# EAGLE design ASD2163 (EAGLE 6.3)
DATABASE: ./../../../../../Components/TinyCircuits_Part_Database.txt
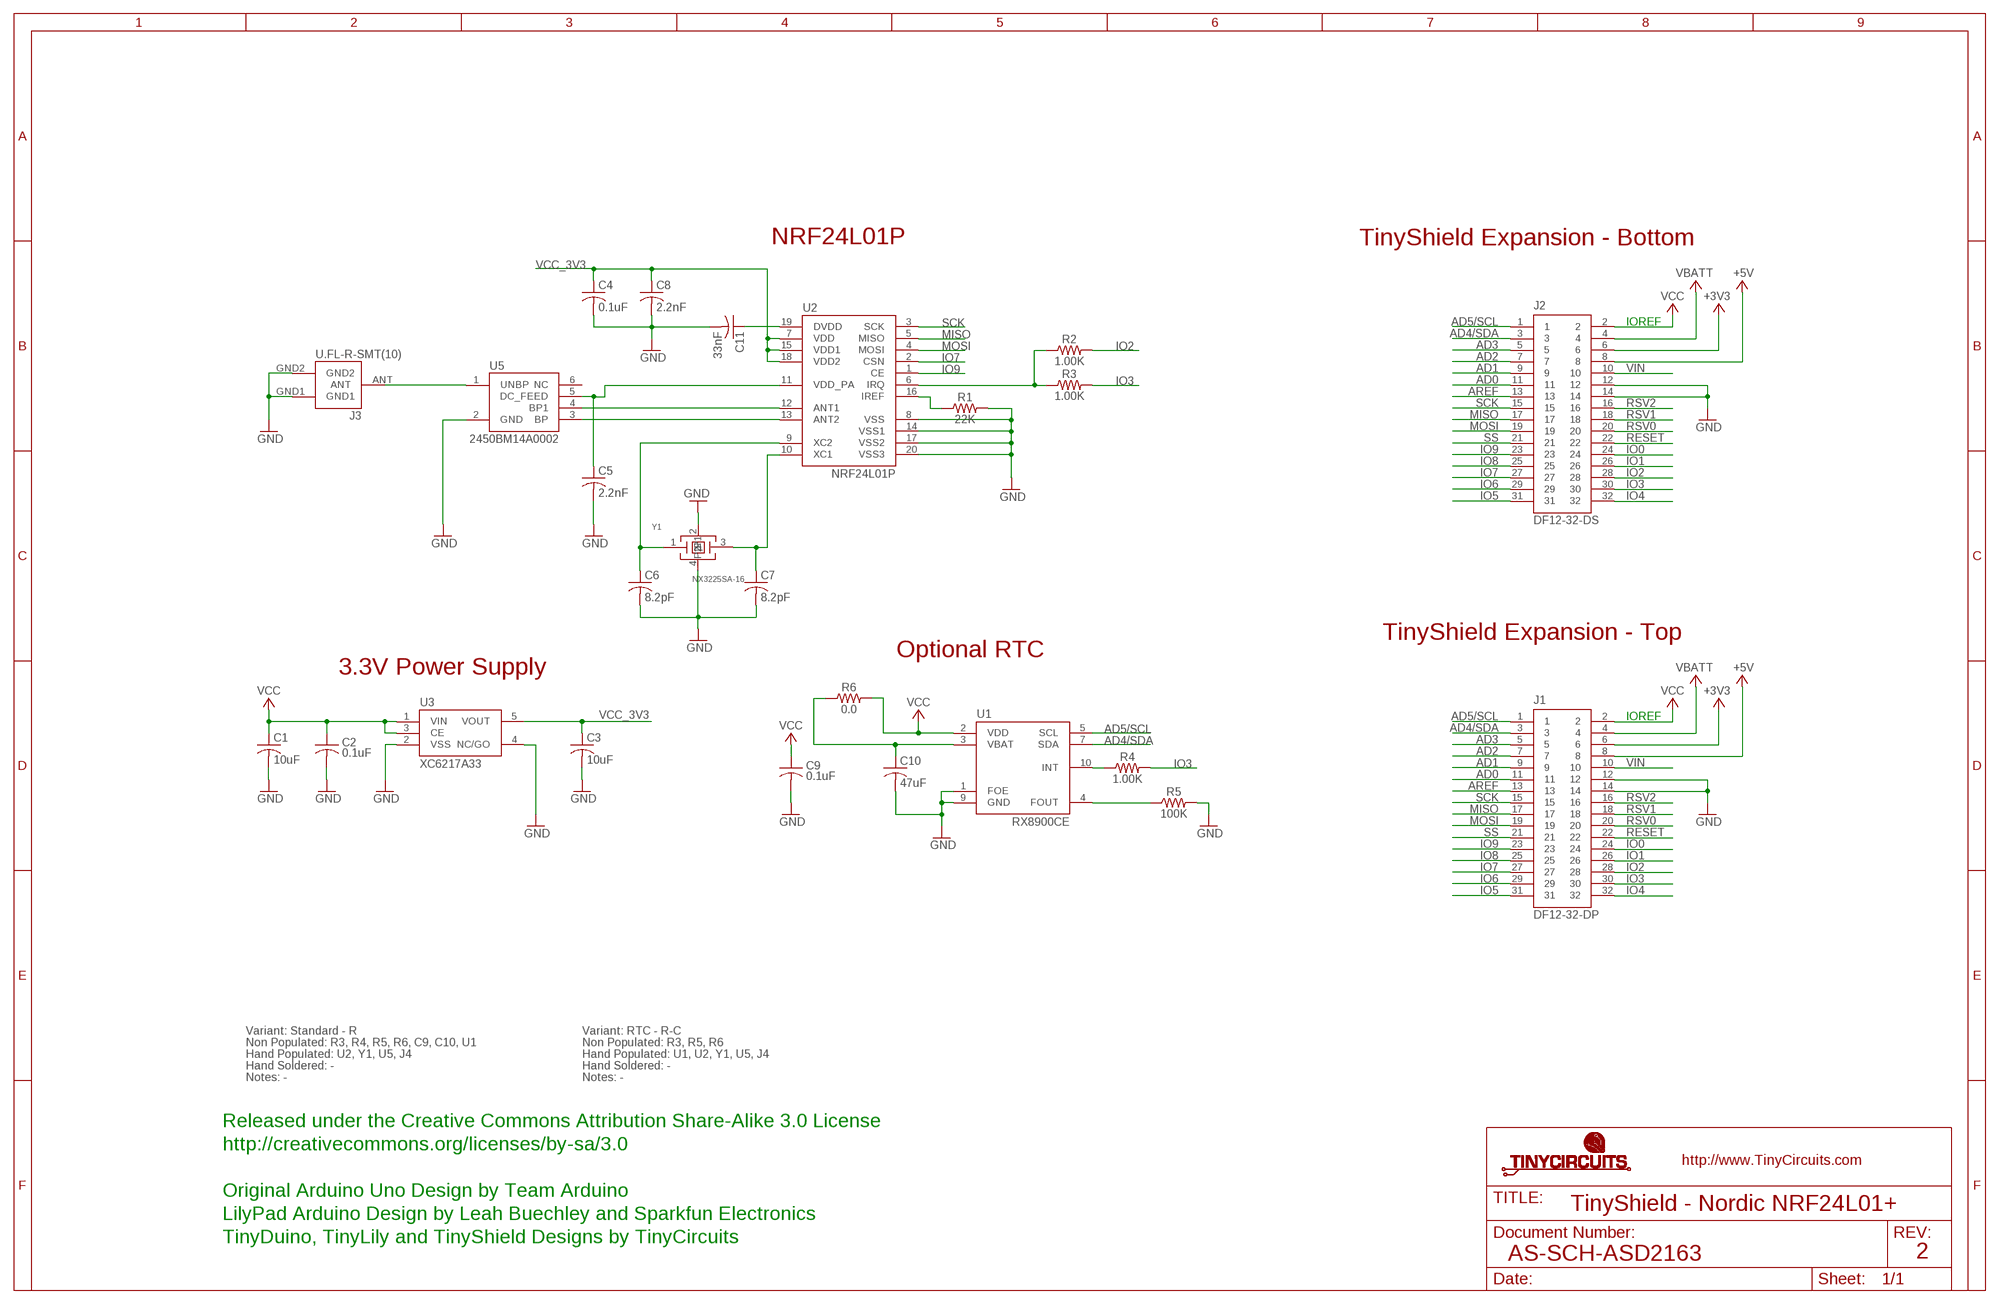
[diagram p0: schematic, sheet 1]

## Parts
C1  10uF  AS-ITM-00002  [C0603]
C2  0.1uF  AS-ITM-00008  [C0402]
C3  10uF  AS-ITM-00002  [C0603]
C4  0.1uF  AS-ITM-00008  [C0402]
C5  2.2nF  AS-ITM-00085  [C0402]
C6  8.2pF  AS-ITM-00247  [C0402]
C7  8.2pF  AS-ITM-00247  [C0402]
C8  2.2nF  AS-ITM-00085  [C0402]
C9  0.1uF  AS-ITM-00008  [C0402]
C10  47uF  AS-ITM-00049  [C1206]
C11  33nF  AS-ITM-00248  [C0402]
J1  DF12-32-DP  AS-ITM-00015  [DF12-32-DP]
J2  DF12-32-DS  AS-ITM-00012  [DF12-32-DS]
J3  U.FL-R-SMT(10)  AS-ITM-00193  [U.FL-R-SMT(10)]
R1  22K  AS-ITM-00147  [0402]
R2  1.00K  AS-ITM-00003  [0402]
R3  1.00K  AS-ITM-00003  [0402]
R4  1.00K  AS-ITM-00003  [0402]
R5  100K  AS-ITM-00004  [0402]
R6  0.0  AS-ITM-00076  [0402]
U1  RX8900CE  AS-ITM-00373  [RX8900CE]
U2  NRF24L01P  AS-ITM-00276  [QFN20-NO_PAD]
U3  XC6217A33  AS-ITM-00249  [SOT-25]
U5  2450BM14A0002  AS-ITM-00114  [2450BM14A0002]
Y1  NX3225SA-16  AS-ITM-00228  [ABM11]

## Nets
+3V3: J1.6 J2.6
+5V: J1.8 J2.8
AD0: J1.11 J2.11
AD1: J1.9 J2.9
AD2: J1.7 J2.7
AD3: J1.5 J2.5
AD4/SDA: J1.3 J2.3 U1.7(SDA)
AD5/SCL: J1.1 J2.1 U1.5(SCL)
AREF: J1.13 J2.13
GND: C1.2 C2.2 C3.2 C4.2 C5.2 C6.2 C7.2 C8.2 C9.2 C10.2 C11.2 J1.12 J1.14 J2.12 J2.14 J3.GND1 J3.GND2 R1.2 R5.2 U1.1(FOE) U1.9(GND) U2.8(VSS) U2.14(VSS1) U2.17(VSS2) U2.20(VSS3) U3.2(VSS) U3.4(NC/GO) U5.2(GND) Y1.2 Y1.4(P1)
IO0: J1.24 J2.24
IO1: J1.26 J2.26
IO2: J1.28 J2.28 R2.2
IO3: J1.30 J2.30 R3.2 R4.2
IO4: J1.32 J2.32
IO5: J1.31 J2.31
IO6: J1.29 J2.29
IO7: J1.27 J2.27 U2.2(CSN)
IO8: J1.25 J2.25
IO9: J1.23 J2.23 U2.1(CE)
MISO: J1.17 J2.17 U2.5(MISO)
MOSI: J1.19 J2.19 U2.4(MOSI)
N$1: R1.1 U2.16(IREF)
N$2: C6.1 U2.9(XC2) Y1.1
N$3: J3.ANT U5.1(UNBP)
N$4: C10.1 R6.1 U1.3(VBAT)
N$5: C11.1 U2.19(DVDD)
N$6: U2.13(ANT2) U5.3(BP)
N$7: U2.12(ANT1) U5.4(BP1)
N$8: C5.1 U2.11(VDD_PA) U5.5(DC_FEED)
N$9: C7.1 U2.10(XC1) Y1.3
N$10: R5.1 U1.4(FOUT)
RDYN: R2.1 R3.1 U2.6(IRQ)
RDYN1: R4.1 U1.10(INT)
RESET: J1.22 J2.22
RSV0: J1.20 J2.20
RSV1: J1.18 J2.18
RSV2: J1.16 J2.16
SCK: J1.15 J2.15 U2.3(SCK)
SS: J1.21 J2.21
VBATT: J1.4 J2.4
VCC: C1.1 C2.1 C9.1 J1.2 J2.2 R6.2 U1.2(VDD) U3.1(VIN) U3.3(CE)
VCC_3V3: C3.1 C4.1 C8.1 U2.7(VDD) U2.15(VDD1) U2.18(VDD2) U3.5(VOUT)
VIN: J1.10 J2.10
Unconnected: U5.6(NC)

## Notes on the sheet
- NRF24L01P | TinyShield Expansion - Bottom
- IOREF
- TinyShield Expansion - Top
- Optional RTC
- 3.3V Power Supply
- IOREF
- Variant: Standard - R | Variant: RTC - R-C
- Non Populated: R3, R4, R5, R6, C9, C10, U1 | Non Populated: R3, R5, R6
- Hand Populated: U2, Y1, U5, J4 | Hand Populated: U1, U2, Y1, U5, J4
- Hand Soldered: - | Hand Soldered: -
- Notes: - | Notes: -
- Released under the Creative Commons Attribution Share-Alike 3.0 License
- http://creativecommons.org/licenses/by-sa/3.0
- Original Arduino Uno Design by Team Arduino
- TinyShield - Nordic NRF24L01+
- LilyPad Arduino Design by Leah Buechley and Sparkfun Electronics
- TinyDuino, TinyLily and TinyShield Designs by TinyCircuits
- AS-SCH-ASD2163 | 2

## Library data of the parts
C1 C3 = tinycircuits:AS-ITM-00002: CAP CER 10UF 10V 20% X5R 0603; PARTNO: AS-ITM-00002
C2 C4 C9 = tinycircuits:AS-ITM-00008: CAP CER 0.1UF 16V 10% X5R 0402; PARTNO: AS-ITM-00008
C5 C8 = tinycircuits:AS-ITM-00085: CAP CER 2.2NF 50V 10% X7R 0402; PARTNO: AS-ITM-00085
C6 C7 = tinycircuits:AS-ITM-00247: CAP CER 8.2PF 50V NP0 0402; PARTNO: AS-ITM-00247
C10 = tinycircuits:AS-ITM-00049: CAP CER 47UF 6.3V 20% X6S 1206; PARTNO: AS-ITM-00049
C11 = tinycircuits:AS-ITM-00248: CAP CER 0.033UF 16V Y5V 0402; PARTNO: AS-ITM-00248
J1 = tinycircuits:AS-ITM-00015: CONN HEADER 32POS 3MM SMD 0.5MM; PARTNO: AS-ITM-00015; PNPROTATION: 0
J2 = tinycircuits:AS-ITM-00012: CONN RECEPT 32POS 3MM SMD 0.5MM; PARTNO: AS-ITM-00012; PNPROTATION: 0
J3 = tinycircuits:AS-ITM-00193: RF COAXIAL CONNECTOR U.FL RECEPTACLE SMT; PARTNO: AS-ITM-00193; PNPROTATION: 270
R1 = tinycircuits:AS-ITM-00147: RES 22K OHM 1/16W 5% 0402 SMD; PARTNO: AS-ITM-00147
R2-R4 = tinycircuits:AS-ITM-00003: RES 1.00K OHM 1/16W 1% 0402; PARTNO: AS-ITM-00003
R5 = tinycircuits:AS-ITM-00004: RES 100K OHM 1/16W 1% 0402; PARTNO: AS-ITM-00004
R6 = tinycircuits:AS-ITM-00076: RES 0.0 OHM 1/16W 1% 0402 SMD; PARTNO: AS-ITM-00076
U1 = tinycircuits:AS-ITM-00373: IC RTC CLK/CALENDAR I2C 10SMD; PARTNO: AS-ITM-00373
U2 = tinycircuits:AS-ITM-00276: IC RF TRANSCEIVER 2.4GHZ 20QFN; PARTNO: AS-ITM-00276
U3 = tinycircuits:AS-ITM-00249: IC REG LDO 3.3V 0.2A SOT25; PARTNO: AS-ITM-00249; PNPROTATION: 270
U5 = tinycircuits:AS-ITM-00114: 2.45 GHz Impredance Matched Balun-Filter; PARTNO: AS-ITM-00114
Y1 = tinycircuits:AS-ITM-00228: CRYSTAL 16MHZ 8PF SMD; PARTNO: AS-ITM-00228; PNPROTATION: 0; VALUE: 8Y-16.000MAAV-T

## Board
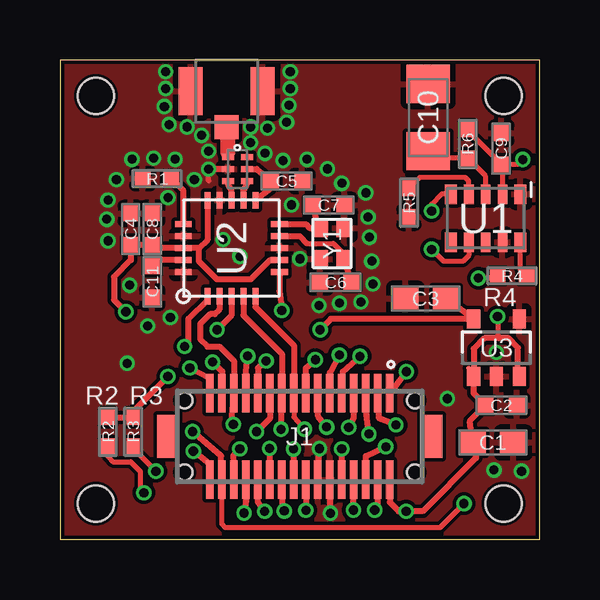
[diagram p1: board, top side]
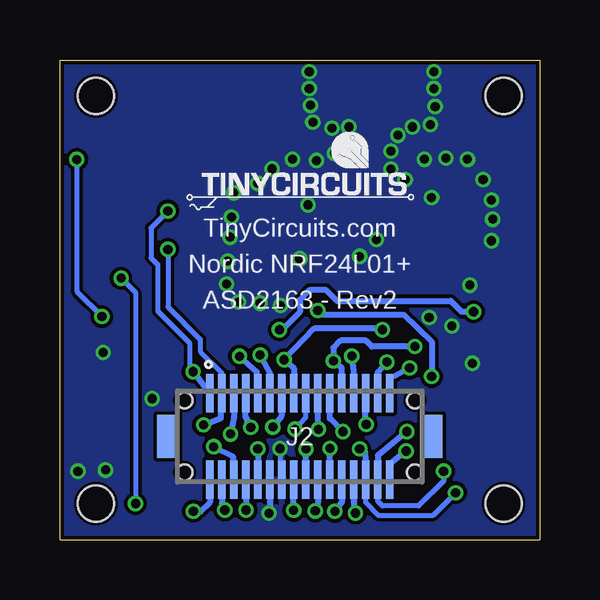
[diagram p2: board, bottom side, seen from below]

Size 20 x 20 mm. Coordinates in mm from the lower left corner, seen from the top.
Outline: 20,0 0,0 0,20 20,20 20,0
Copper layers (1*16): Top 0.035mm / dielectric 1.5mm / Bottom 0.035mm
Design rules "default *": minimum track width 7mil, minimum drill 15mil, track to track 6mil, track to pad 6mil, pad to pad 6mil, via to via 6mil, smd to smd 6mil, copper to edge 6mil, drill to drill 8mil, minimum pad ring 10mil, minimum via ring 5mil, stop-mask expansion 4mil, vias tented up to drill 25mil, thermal gap 10mil
Holes 1.5 mm at 1.5,18.5 18.5,18.5 18.5,1.5 1.5,1.5

### Footprints (pad centres in the part's own frame; a part is rotated, then mirrored left to right if it is on the bottom)
C0603 = smd 1.1 x 1: 1 -0.85,0; 2 0.85,0
C0402 = smd 0.65 x 0.6: 1 -0.65,0; 2 0.65,0
C1206 = smd 1.6 x 1.8: 1 -1.4,0; 2 1.4,0
DF12-32-DP = smd 0.3 x 1.6: 1 -3.75,-1.8; 2 -3.75,1.8; 3 -3.25,-1.8; 4 -3.25,1.8; 5 -2.75,-1.8; 6 -2.75,1.8; 7 -2.25,-1.8; 8 -2.25,1.8; 9 -1.75,-1.8; 10 -1.75,1.8; 11 -1.25,-1.8; 12 -1.25,1.8; 13 -0.75,-1.8; 14 -0.75,1.8; 15 -0.25,-1.8; 16 -0.25,1.8; 17 0.25,-1.8; 18 0.25,1.8; 19 0.75,-1.8; 20 0.75,1.8; 21 1.25,-1.8; 22 1.25,1.8; 23 1.75,-1.8; 24 1.75,1.8; 25 2.25,-1.8; 26 2.25,1.8; 27 2.75,-1.8; 28 2.75,1.8; 29 3.25,-1.8; 30 3.25,1.8; 31 3.75,-1.8; 32 3.75,1.8 | smd 0.9 x 1.8: F1 -5.5,0; F2 5.5,0 | hole 0.65: -4.8,1.5; 4.8,1.5
DF12-32-DS = smd 0.3 x 1.6: 1 -3.75,1.8; 2 -3.75,-1.8; 3 -3.25,1.8; 4 -3.25,-1.8; 5 -2.75,1.8; 6 -2.75,-1.8; 7 -2.25,1.8; 8 -2.25,-1.8; 9 -1.75,1.8; 10 -1.75,-1.8; 11 -1.25,1.8; 12 -1.25,-1.8; 13 -0.75,1.8; 14 -0.75,-1.8; 15 -0.25,1.8; 16 -0.25,-1.8; 17 0.25,1.8; 18 0.25,-1.8; 19 0.75,1.8; 20 0.75,-1.8; 21 1.25,1.8; 22 1.25,-1.8; 23 1.75,1.8; 24 1.75,-1.8; 25 2.25,1.8; 26 2.25,-1.8; 27 2.75,1.8; 28 2.75,-1.8; 29 3.25,1.8; 30 3.25,-1.8; 31 3.75,1.8; 32 3.75,-1.8 | smd 0.9 x 1.8: F1 -5.5,0; F2 5.5,0 | hole 0.65: -4.8,1.5; 4.8,1.5
U.FL-R-SMT(10) = smd 1 x 1: ANT 0,-1.5 | smd 1 x 2: GND1 -1.5,0; GND2 1.5,0
0402 = smd 0.65 x 0.55: 1 -0.6,0; 2 0.6,0
RX8900CE = smd 0.5 x 0.8: 1 -1.45,-1; 5 1.45,-1; 6 1.45,1; 10 -1.45,1 | smd 0.4 x 0.8: 2 -0.7,-1; 3 0,-1; 4 0.7,-1; 7 0.7,1; 8 0,1; 9 -0.7,1
QFN20-NO_PAD = smd 0.7 x 0.25: 1 -2,1; 2 -2,0.5; 3 -2,0; 4 -2,-0.5; 5 -2,-1; 11 2,-1; 12 2,-0.5; 13 2,0; 14 2,0.5; 15 2,1 | smd 0.25 x 0.7: 6 -1,-2; 7 -0.5,-2; 8 0,-2; 9 0.5,-2; 10 1,-2; 16 1,2; 17 0.5,2; 18 0,2; 19 -0.5,2; 20 -1,2
SOT-25 = smd 0.55 x 0.8: 1 -0.95,-1.2; 2 0,-1.2; 3 0.95,-1.2; 4 0.95,1.2; 5 -0.95,1.2
2450BM14A0002 = smd 0.25 x 0.5: 1 0.5,0.4; 2 0,0.4; 3 -0.5,0.4; 4 -0.5,-0.4; 5 0,-0.4; 6 0.5,-0.4
ABM11 = smd 0.75 x 0.65: 1 -0.65,-0.5; 2 0.65,-0.5; 3 0.65,0.5; 4 -0.65,0.5

### Placement (x,y rotation side)
C1  18.05,4.05 0 top
C2  18.4,5.6 0 top
C3  15.25,10.05 180 top
C4  2.95,12.95 90 top
C5  9.45,14.95 0 top
C6  11.49,10.72 180 top
C7  11.21,13.95 0 top
C8  3.85,12.95 90 top
C9  18.4,16.3 90 top
C10  15.35,17.6 90 top
C11  3.85,10.75 270 top
J1  10,4.3 180 top
J2  10,4.3 0 bottom
J3  6.95,18.7 0 top
R1  4.05,15.05 180 top
R2  2,4.5 270 top
R3  3.05,4.5 270 top
R4  18.85,11 180 top
R5  14.55,14.05 270 top
R6  17,16.5 90 top
U1  17.75,13.4 180 top
U2  7.15,12.15 90 top
U3  18.2,8 0 top
U5  7.4,15.45 90 top
U$1  [DOCFIELD-TINYCIRCUITS-PCB]  33.91,-10 0 top  (outside the outline)
Y1  11.35,12.35 90 top

### Tracks (layer width: path | path; a pad name or v marks a point on that pad's centre or on a via)
+3V3  (via drill 0.38)
  Top 0.254: J2.6 12.75,3.47 v13.59,3.87
  Bottom 0.254: v13.59,3.87 12.79,3.46 J2.6
+5V  (via drill 0.38)
  Top 0.254: v12.24,1.23 J2.8
  Bottom 0.254: J2.8 12.25,1.21 v12.24,1.23
AD0  (via drill 0.38)
  Top 0.254: v11.65,7.7 11.25,6.95 J2.11
  Bottom 0.254: J2.11 11.25,6.95 v11.65,7.7
AD1  (via drill 0.38)
  Top 0.254: J2.9 11.79,7 v12.51,7.64
  Bottom 0.254: v12.51,7.64 11.78,7 J2.9
AD2  (via drill 0.38)
  Top 0.254: v12.04,4.68 12.26,5.11 J2.7
  Bottom 0.254: J2.7 12.27,5.16 v12.04,4.68
AD3  (via drill 0.38)
  Top 0.254: v12.88,4.4 12.78,5.22 J2.5
  Bottom 0.254: J2.5 12.75,5.13 v12.88,4.4
AD4/SDA  (via drill 0.38)
  Top 0.203: U1.7 17.05,11.85 16.8,11.6 16,11.6 v15.5,12.1
  Top 0.254: v14.01,4.78 13.31,5.05 J2.3
  Bottom 0.203: v15.5,12.1 15.5,9.7 14.15,8.35 14.15,7.85 13.25,6.95 J2.3
  Bottom 0.254: J2.3 13.28,5.06 v14.01,4.78
AD5/SCL  (via drill 0.38)
  Top 0.203: U1.5 15.9,14.4 15.5,14 v15.5,13.7
  Top 0.254: v14.45,7 J2.1
  Bottom 0.203: v14.45,7 14.6,7.15 14.6,8.2 15.93,9.52 15.93,11.48 16.2,11.75 16.2,13 v15.5,13.7
  Bottom 0.254: J2.1 v14.45,7
AREF  (via drill 0.38)
  Top 0.254: J2.13 10.77,5.14 v11.12,4.69
  Bottom 0.254: v11.12,4.69 10.77,5.14 J2.13
GND  (via drill 0.38)
  Top 0.203: v11.29,1.1 11.25,1.13 J1.12 11.29,2.46 | 6.2,14.95 v6.2,15.45 | U3.4 19,9.25 | v10.83,3.79 10.75,3.54 J1.14 v10.83,3.79
  Top 0.254: v11.29,1.1 11.29,2.46 | U5.2 v6.2,15.45
  Bottom 0.203: J1.14 v10.83,3.79 | 11.25,1.13 v11.29,1.1
  Bottom 0.254: J1.12 11.25,1.13
  other vias: 16.16,5.88 2.35,15.01 2.8,7.35 18.2,7.8 6.2,16.2 7.95,16.55 12.85,13.45 10,11.71 2.9,10.61 3,15.86 9.65,13.96 12.9,12.61 12.75,14.46 11.75,14.86 11.15,15.46 10.3,15.86 9.3,15.81 7.95,17.21 8.55,16.11 2,14.16 4.6,9.26 6.8,12.51 7.5,11.81 5.6,15.01 4.8,15.86 3.9,15.91 1.95,13.36 2,12.46 10.8,9.76 11.65,9.86 12.55,9.91 13.05,10.66 13,11.61 3.65,8.91 4.5,14.26 18.1,2.9 19.25,2.85 5.9,16.86 5.3,17.21 8.65,17.16 9.45,17.41 9.55,18.11 9.6,18.81 9.6,19.51 4.55,17.31 4.35,18.06 4.4,18.81 4.4,19.51
  pour Top: 0,20 20,20 20,0 0,0
  pour Bottom: 0,20 20,20 20,0 0,0
IO0  (via drill 0.38)
  Top 0.254: v8.54,1.18 8.25,1.56 J2.24
  Bottom 0.254: J2.24 8.25,1.56 v8.54,1.18
IO1  (via drill 0.38)
  Top 0.254: J2.26 7.75,1.63 v7.67,1.1
  Bottom 0.203: 7.73,2.48 J2.26
  Bottom 0.254: v7.67,1.1 7.73,1.61 7.73,2.48
IO2  (via drill 0.38)
  Top 0.203: R2.2 2,3.45 2.2,3.25 2.95,3.25 3.35,2.85 3.35,2.1 v3.5,1.95
  Top 0.254: v7.5,3.78 7.33,3.66 7.22,3.49 7.29,2.61 7.26,2.51 J2.28
  Bottom 0.203: v3.5,1.95 4.45,1 6.7,1 7.25,1.55 J2.28
  Bottom 0.254: J2.28 7.24,3.43 7.28,3.65 v7.5,3.78
IO3  (via drill 0.38)
  Top 0.203: R3.2 3.05,3.8 v4,2.85 | R4.2 18.15,10.9 v17.45,10.9 | v16.85,1.5 15.85,0.5 6.9,0.5 6.75,0.65 J2.30
  Top 0.254: J2.30 6.73,3.49 v5.53,4.5
  Bottom 0.203: v4,2.85 4,2.45 5.05,1.4 6.55,1.4 6.75,1.6 J2.30 | v17.45,10.9 16.85,10.3 v16.85,1.5
  Bottom 0.254: v5.53,4.5 6.75,3.51 6.77,2.53 J2.30
IO4  (via drill 0.38)
  Top 0.254: J2.32 6.25,3.14 v5.56,3.69
  Bottom 0.254: v5.56,3.69 5.61,3.65 6.21,3.18 6.21,3.14 6.26,3.1 J2.32
IO5  (via drill 0.38)
  Top 0.254: v5.42,7.16 6.23,6.73 J2.31
  Bottom 0.254: J2.31 6.26,6.69 v5.42,7.16
IO6  (via drill 0.38)
  Top 0.254: J2.29 6.76,7.01 v6.36,7.4
  Bottom 0.254: J2.29 6.75,6.98 v6.36,7.4
IO7  (via drill 0.38)
  Top 0.254: v7.23,4.8 7.16,4.95 J2.27 7.25,7.45 6.65,8.05 6.15,8.05 5.85,8.35 5.85,9 6.25,9.4 6.45,9.4 6.65,9.6 U2.2
  Bottom 0.254: J2.27 7.29,5.76 v7.23,4.8
IO8  (via drill 0.38)
  Top 0.203: 7.78,6.13 J2.25
  Top 0.254: J2.25 7.75,7.02 v7.83,7.65
  Bottom 0.254: J2.25 7.75,7.02 v7.83,7.65
IO9  (via drill 0.38)
  Top 0.254: v8.6,7.45 8.25,7.15 J2.23 | U2.1 6.15,10 5.35,9.2 5.35,8.2 v5.2,8.05
  Bottom 0.254: J2.23 8.25,7.15 v8.6,7.45 8.6,8 8.3,8.3 7.25,8.3 7,8.05 v5.2,8.05
MISO  (via drill 0.38)
  Top 0.203: 9.74,6.11 J2.17 9.75,5.1 v10.2,4.6
  Top 0.254: U2.5 8.15,9.7 9.75,8.1 J2.17
  Bottom 0.203: v10.2,4.6 9.75,5.1 J2.17
MOSI  (via drill 0.38)
  Top 0.254: v9.22,4.6 9.23,5.26 J2.19 9.25,7.75 7.65,9.35 U2.4
  Bottom 0.254: J2.19 9.25,5.26 v9.22,4.6
N$1
  Top 0.254: U2.16 5.15,14.55 R1.1
N$2
  Top 0.203: 10.3,12.35 11.4,12.35 11.85,11.9
  Top 0.254: U2.9 10,12.65 10.3,12.35 | 11.85,11.9 Y1.1 11.87,11.68 C6.1
N$3
  Top 0.254: U5.1 7,16.15
  Top 0.635: 7,16.15 7,17.2 | 7,17.2 7,17.3 arc90 7,17.2 | 7,17.2 arc-90 J3.ANT
N$4
  Top 0.203: U1.3 17.75,15.15 R6.1 15.8,15.9 C10.1
N$5
  Top 0.254: U2.19 3.95,11.65 3.85,11.55 C11.1
N$6
  Top 0.254: U5.3 arc45 7.1,14.65 arc-45 7.15,14.5 U2.13
N$7
  Top 0.254: U5.4 arc-45 7.7,14.65 arc45 7.65,14.5 U2.12
N$8
  Top 0.254: U2.11 8.8,14.65 C5.1 8.2,15.45 U5.5
N$9
  Top 0.254: U2.10 10.25,13.15 10.4,13 Y1.3 10.76,13.09 C7.1
N$10
  Top 0.203: U1.4 17.05,14.95 16.9,15.1 15,15.1 R5.1
RDYN  (via drill 0.38)
  Top 0.254: U2.6 9.15,10.35 v9.25,9.55 | R2.1 R3.1 3.05,5.35 v4.5,6.8
  Bottom 0.254: v9.25,9.55 9.1,9.38 5.68,9.38 4.5,8.25 v4.5,6.8
RDYN1
  Top 0.203: R4.1 19.2,11.25 U1.10
RESET  (via drill 0.38)
  Top 0.254: v8.74,3.8 J2.22
  Bottom 0.254: J2.22 8.75,3.69 v8.74,3.8
RSV0  (via drill 0.38)
  Top 0.254: J2.20 9.25,1.2 v9.36,1.19
  Bottom 0.254: J2.20 9.25,1.84 9.25,1.2 v9.36,1.19
RSV1  (via drill 0.38)
  Top 0.254: v9.74,3.77 9.74,2.51 J2.18
  Bottom 0.254: J2.18 9.75,3.72 v9.74,3.77
RSV2  (via drill 0.38)
  Top 0.254: J2.16 10.25,1.16 v10.25,1.22
  Bottom 0.254: v10.25,1.22 J2.16
SCK  (via drill 0.38)
  Top 0.254: J2.15 10.25,7.15 v10.65,7.5 | U2.3 7.15,9.35 v6.55,8.75
  Bottom 0.254: J2.15 10.25,7.15 v10.65,7.5 9.4,8.8 6.5,8.8 v6.55,8.75
SS  (via drill 0.38)
  Top 0.254: J2.21 8.75,5.05 v8.2,4.5
  Bottom 0.254: v8.2,4.5 8.75,5.05 J2.21
VBATT  (via drill 0.38)
  Top 0.254: v13.13,1.23 13.25,1.48 J2.4
  Bottom 0.254: J2.4 13.25,1.5 v13.13,1.23
VCC  (via drill 0.38)
  Top 0.2: 17.05,7.15 U3.1 | v14.44,1.18 14.47,1.15 | U3.3 19.1,6.85
  Top 0.203: C9.1 19.1,15.65 v19.3,15.85 | v18.25,9.3 18.25,8.45 18.3,8.4 | C9.1 18.45,15.6 U1.2 | R6.2 17,17.05 C9.1
  Top 0.254: J2.2 13.75,1.56 14.13,1.18 14.38,1.18 v14.44,1.18 15.13,1.18 17.35,3.4 C1.1 17.1,4.95 C2.1 17.25,6.1 U3.1 17.25,7.95 17.7,8.4 18.3,8.4 18.7,8.4 19.1,8 19.1,6.85
  Bottom 0.203: v19.3,15.85 19.3,10.35 v18.25,9.3
  Bottom 0.254: v14.44,1.18 14.38,1.18 14.13,1.18 13.75,1.56 J2.2
VCC_3V3  (via drill 0.38)
  Top 0.254: C3.1 U3.5 11.3,9.2 v10.85,8.75 | U2.7 8.75,11.65 7.95,10.85 6.55,10.85 5.8,11.6 5.8,12.15 | 5.8,12.15 U2.18 4,12.15 C8.1 C4.1 2.95,11.65 2.25,10.95 2.25,10 v2.75,9.5 | U2.15 6.15,12.5 5.8,12.15
  Bottom 0.254: v2.75,9.5 3.25,9.5 3.7,9.95 8.45,9.95 8.9,10.4 9.6,10.4 10,10 10,9.5 10.75,8.75 v10.85,8.75
VIN  (via drill 0.38)
  Top 0.254: J2.10 v11.76,3.78 v11.75,3.78
  Bottom 0.254: v11.75,3.78 J2.10

### Text on the board
tPlace: R4 | R2 | R3
bPlace: TinyCircuits.com | Nordic NRF24L01+ | ASD2163 - Rev2
Document: FABRICATION DRAWING | NOTES: | 1. PRINTED CIRCUIT BOARD MADE FROM NEMA GRADE FR-4 EPOXY LAMINATE | WITH 1 OUNCE COPPER PLATING AND .024 THICKNESS. | 2. ALL DIMENSIONS ARE GIVEN IN INCHES. | 3. CIRCUIT PATHS ARE FOR REFERENCE ONLY. | 4. HOLE SIZES SHOWN ARE FINISHED DIAMETERS AFTER PLATING. | 5. BOARD PLATED USING REFLOW OR SIMILAR METHOD. | 6. BOARD TO HAVE BLUE SOLDER MASK ON PLATED SURFACES USING WET FILM | 7. SILKSCREEN BOARD USING WHITE INK. | SR100 OR SR1010 EPOXY. EQUIVALENT WET OR DRY FILM MAY BE USED. | 8. THE FOLLOWING INFORMATION APPLIES TO THIS BOARD: | * 2 COPPER LAYERS | * .024 BOARD THICKNESS | * REQUIRES TOP SIDE SILKSCREEN | Released under the Creative Commons Attribution Share-Alike 3.0 License | http://creativecommons.org/licenses/by-sa/3.0 | Original Arduino Uno Design by Team Arduino | LilyPad Arduino Design by Leah Buechley and Sparkfun Electronics | TinyDuino, TinyLily and TinyShield Designs by TinyCircuits | TinyShield - Nordic NRF24L01+ | AS-PCB-ASD2163 | 2